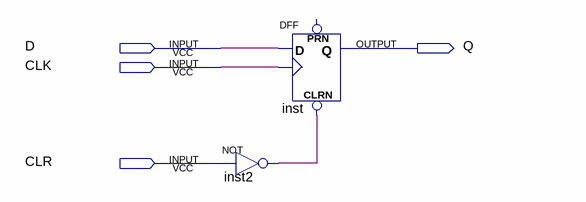
[diagram p0: schematic sheet]
// Quartus schematic D_FF_AC.bdf as structural Verilog: 2 symbols, 4 pins
module D_FF_AC (
  input  D,
  input  CLK,
  input  CLR,
  output Q
);

  wire inst2_out;

  not inst2 (inst2_out, CLR);
  DFF inst (.CLRN(inst2_out), .CLK(CLK), .D(D), .Q(Q));  // open: PRN
endmodule
